# EAGLE schematic Botdozer_HZ (EAGLE 7.4.0)
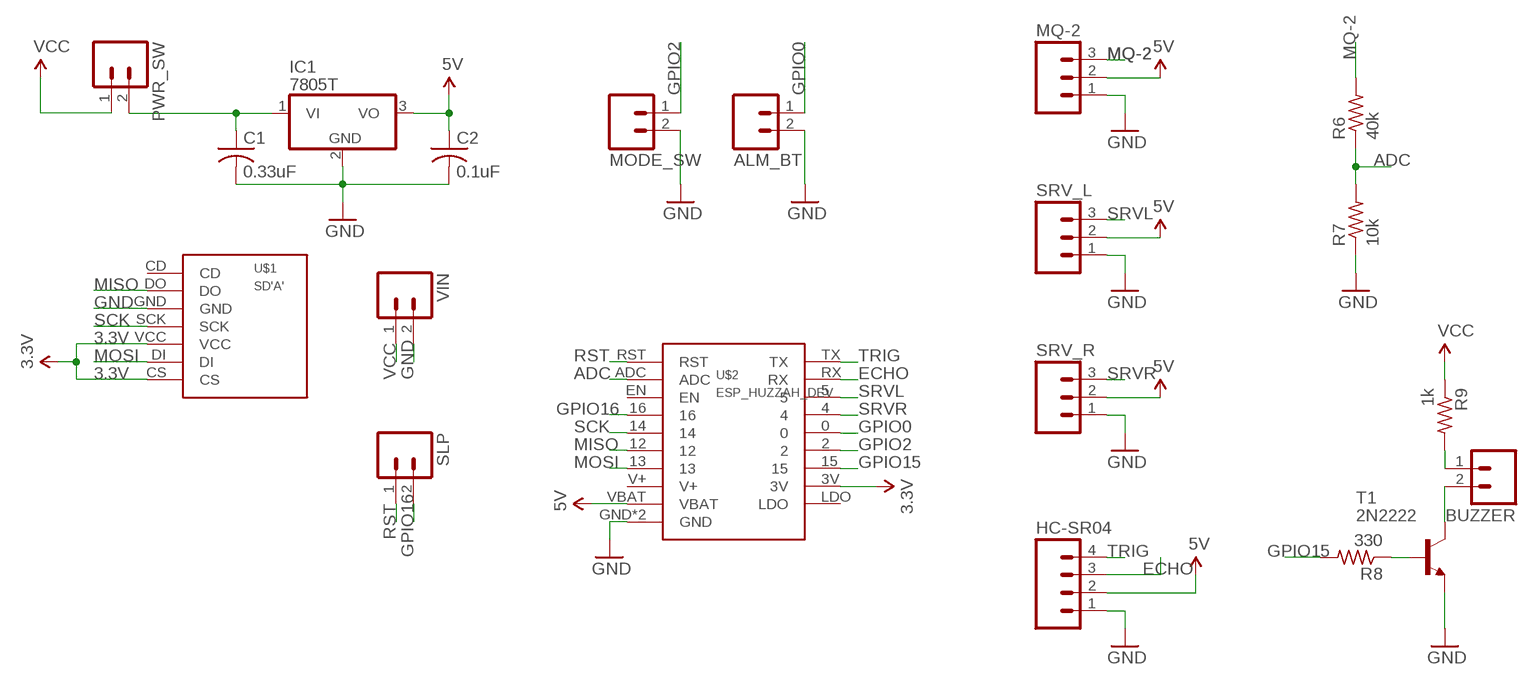
[diagram p0: schematic, sheet 1]

## Parts
ALM_BT  M02PTH  [1X02]
BUZZER  M02PTH  [1X02]
C1  0.33uF  C-US025-025X050  [C025-025X050]
C2  0.1uF  C-US025-025X050  [C025-025X050]
HC-SR04  M04PTH  [1X04]
IC1  7805T  [TO220H]
MODE_SW  M02PTH  [1X02]
MQ-2  M03PTH  [1X03]
PWR_SW  M02PTH  [1X02]
R6  40k  R-US_0207/10  [0207/10]
R7  10k  R-US_0207/10  [0207/10]
R8  330  R-US_0207/10  [0207/10]
R9  1k  R-US_0207/10  [0207/10]
SLP  M02PTH  [1X02]
SRV_L  M03PTH  [1X03]
SRV_R  M03PTH  [1X03]
T1  2N2222  [TO92-EBC-OVAL]
U$1  SD'A'  [SD_BR]
U$2  ESP_HUZZAH_DEV  [ESP_HUZZAH_FP]
VIN  M02PTH  [1X02]

## Nets
3.3V: U$1.CS U$1.VCC U$2.3V
5V: C2.1 HC-SR04.2 IC1.3(VO) MQ-2.2 SRV_L.2 SRV_R.2 U$2.VBAT
ADC: R6.1 R7.2 U$2.ADC
ECHO: HC-SR04.3 U$2.RX
GND: ALM_BT.2 C1.2 C2.2 HC-SR04.1 IC1.2(GND) MODE_SW.2 MQ-2.1 R7.1 SRV_L.1 SRV_R.1 T1.E U$1.GND U$2.GND U$2.GND1(GND) VIN.2
GPIO0: ALM_BT.1 U$2.0
GPIO2: MODE_SW.1 U$2.2
GPIO15: R8.2 U$2.15
GPIO16: SLP.2 U$2.16
MISO: U$1.DO U$2.12
MOSI: U$1.DI U$2.13
MQ-2: MQ-2.3 R6.2
N$1: BUZZER.2 T1.C
N$2: R8.1 T1.B
N$3: C1.1 IC1.1(VI) PWR_SW.2
N$4: BUZZER.1 R9.2
RST: SLP.1 U$2.RST
SCK: U$1.SCK U$2.14
SRVL: SRV_L.3 U$2.5
SRVR: SRV_R.3 U$2.4
TRIG: HC-SR04.4 U$2.TX
VCC: PWR_SW.1 R9.1 VIN.1
Unconnected: U$1.CD U$2.EN U$2.LDO U$2.V+

## Library data of the parts
ALM_BT BUZZER MODE_SW PWR_SW SLP VIN = SparkFun-Connectors:M02: Standard 2-pin 0.1" header. Use with - straight break away headers ( PRT-00116) - right angle break away headers (PRT-00553) - swiss pins (PRT-00743) - machine pins (PRT-00117) - female headers (PRT-00115) Molex polarized connector foot print use with: PRT-08233 with associated crimp pins and housings. 2.54_SCREWTERM for use with PRT-10571. 3.5mm Screw Terminal footprints for PRT-08084 5mm Screw Terminal footprints for use with PRT-08432
C1 C2 = adafruit:C-US: CAPACITOR, American symbol
HC-SR04 = SparkFun-Connectors:M04: Header 4 Standard 4-pin 0.1" header. Use with straight break away headers (SKU : PRT-00116), right angle break away headers (PRT-00553), swiss pins (PRT-00743), machine pins (PRT-00117), and female headers (PRT-00115). Molex polarized connector foot print use with SKU : PRT-08231 with associated crimp pins and housings. 1MM SMD Version SKU: PRT-10208; PROD_ID: CONN-09696
IC1 = adafruit:78*: Positive VOLTAGE REGULATOR Added bigger pads to the TO-92 package
MQ-2 SRV_L SRV_R = SparkFun-Connectors:M03: Header 3 Standard 3-pin 0.1" header. Use with straight break away headers (SKU : PRT-00116), right angle break away headers (PRT-00553), swiss pins (PRT-00743), machine pins (PRT-00117), and female headers (PRT-00115). Molex polarized connector foot print use with SKU : PRT-08232 with associated crimp pins and housings.
R6-R9 = adafruit:R-US_: RESISTOR, American symbol
T1 = adafruit:2N2222: NPN TRANSISTOR Big oval pads
U$1 = rac:SD
U$2 = rac:ESP_HUZZAH_DEV